# Altium schematic sheet SPDIF.SchDoc
size A4; Date: 08.04.2017; ApprovedBy: ApprovedBy; CheckedBy: CheckedBy; Author: Jan Petrik; CompanyName: FreeDSP; DrawnBy: Jan Petrik; Organization: FreeDSP; DocumentNumber: 13; Revision: B2; SheetNumber: 13; SheetTotal: 16; Version1: N/A; Version2: N/A; Version3: N/A; Change1description: N/A; Change2description: N/A; Change3description: N/A; Change1DrawnBy: N/A; Change2DrawnBy: N/A; Change3DrawnBy: N/A; Change1CheckedBy: N/A; Change2CheckedBy: N/A; Change3CheckedBy: N/A; PreviusVersion_Chng1: N/A; PreviusVersion_Chng2: N/A; PreviusVersion_Chng3: N/A; Variant1description: Standard assembly; Variant2description: N/A; Variant3description: N/A; Variant4description: N/A; email: jan_petrik@centrum.cz; license: CC BY-NC 4.0; PageSetup: Record=PageOptions|CenterHorizontal=True|CenterVertical=True|PrintScale=0.97|XCorrection=1.00|YCorrection=1.00|PrintKind=2|BorderSize=5000000|LeftOffset=0|BottomOffset=0|Orientation=2|PaperLength=1000|PaperWidth=1000|Scale=100|PaperSource=7|PrintQuality=-3|MediaType=1|DitherType=10|PrintScaleMode=1|PaperKind=A4|PaperIndex=9; drawing number: blablabla; DocumentName: Docname
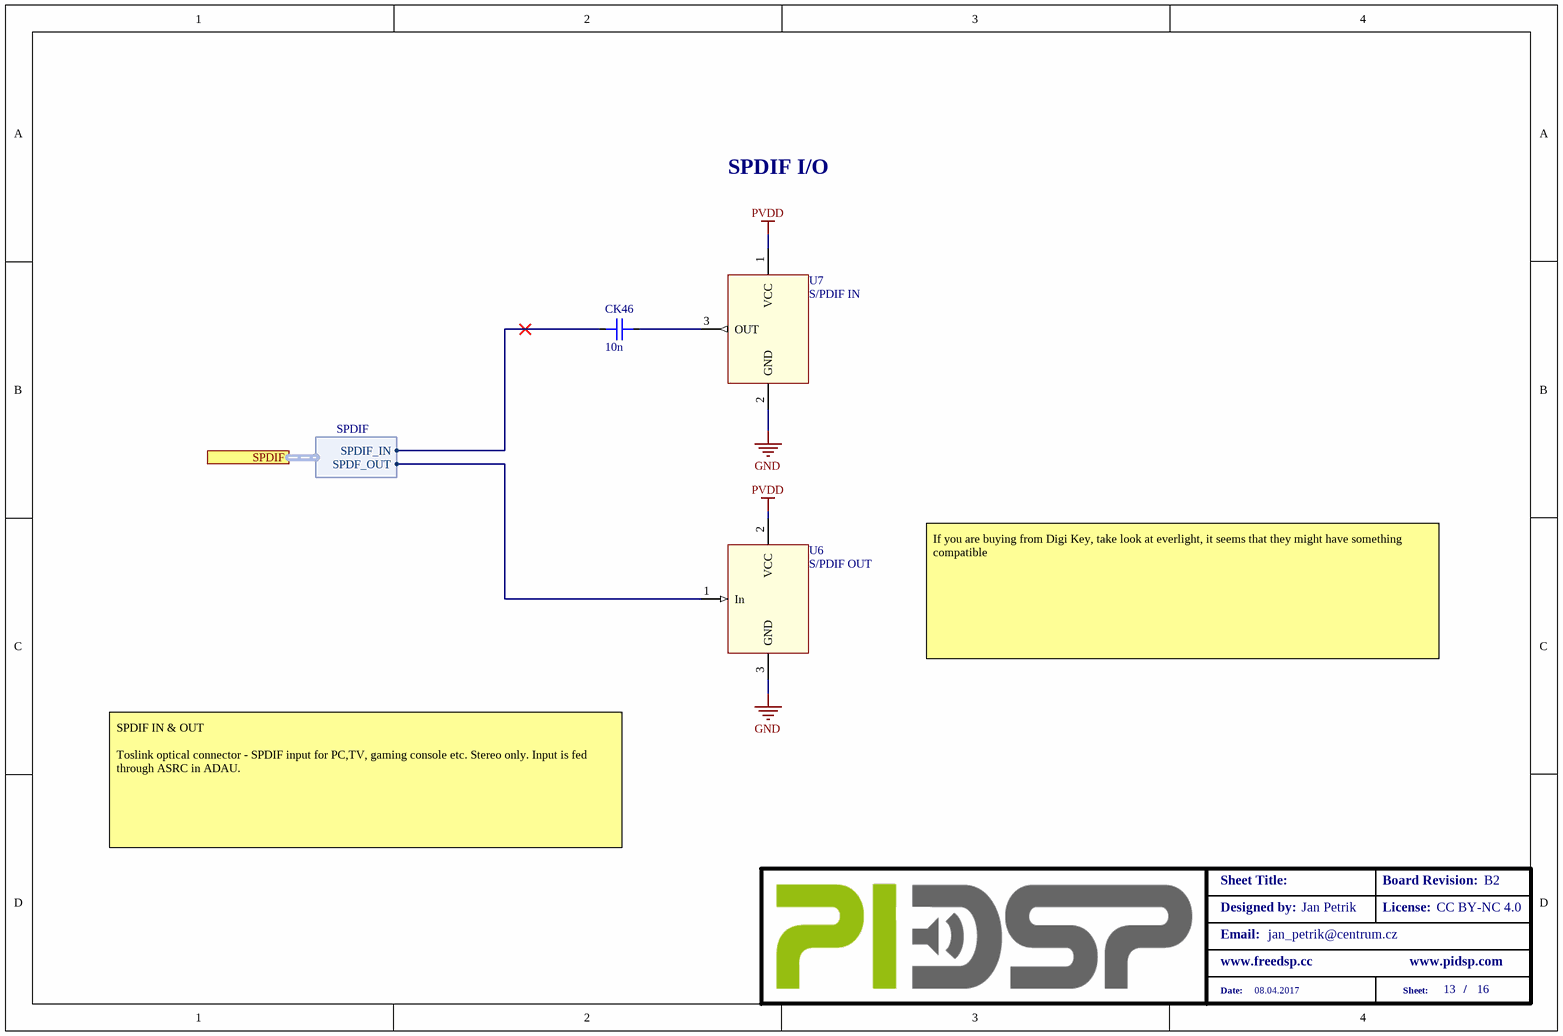
[diagram p0: SPDIF.SchDoc]

## Parts
CK46  10n  [CAPC1608X09N(SMC0603)]
U6  S/PDIF OUT  [OTJ/ORJ 8]
U7  S/PDIF IN  [OTJ/ORJ 8]

## Ports
SPDIF (harness SPDIF)

## Harnesses
SPDIF: SPDIF_IN, SPDF_OUT

## Nets
GND: U6.3(GND) U7.2(GND)
PVDD: U6.2(VCC) U7.1(VCC)
NetCK46_1: CK46.1 U7.3(OUT)
NetCK46_2: CK46.2 ; port SPDIF.SPDIF_IN
NetU6_1: U6.1(In) ; port SPDIF.SPDF_OUT

## Notes on the sheet
- SPDIF I/O
- If you are buying from Digi Key, take look at everlight, it seems that they might have something compatible
- SPDIF IN & OUT
  Toslink optical connector - SPDIF input for PC,TV, gaming console etc. Stereo only. Input is fed through ASRC in ADAU.
- Designed by:
- Sheet Title:
- Board Revision:
- License:
- Email:
- www.freedsp.cc
- www.pidsp.com
- Date:
- Sheet:
- /

## Library data of the parts
CK46 = 10n-50V-0603-X7R: MLCC; Signal Integrity: Cap; Tolerance: 10%; Voltage: 50V; Value: 10n; Package: SMC0603; Simulation: Cap; Author: JP/27.03.2014; Supplier 1: Mouser; Supplier Part Number 1: 81-GRM39X103K50D
U6 = OTJ-8: Toslink Transmitter; Value: OTJ-8; SMD: 0; Supplier 1: TME; Supplier Part Number 1: FC684208T
U7 = ORJ-8: Toslink Reciever; Value: ORJ-8; SMD: 0; Supplier 1: TME; Supplier Part Number 1: FC684208R